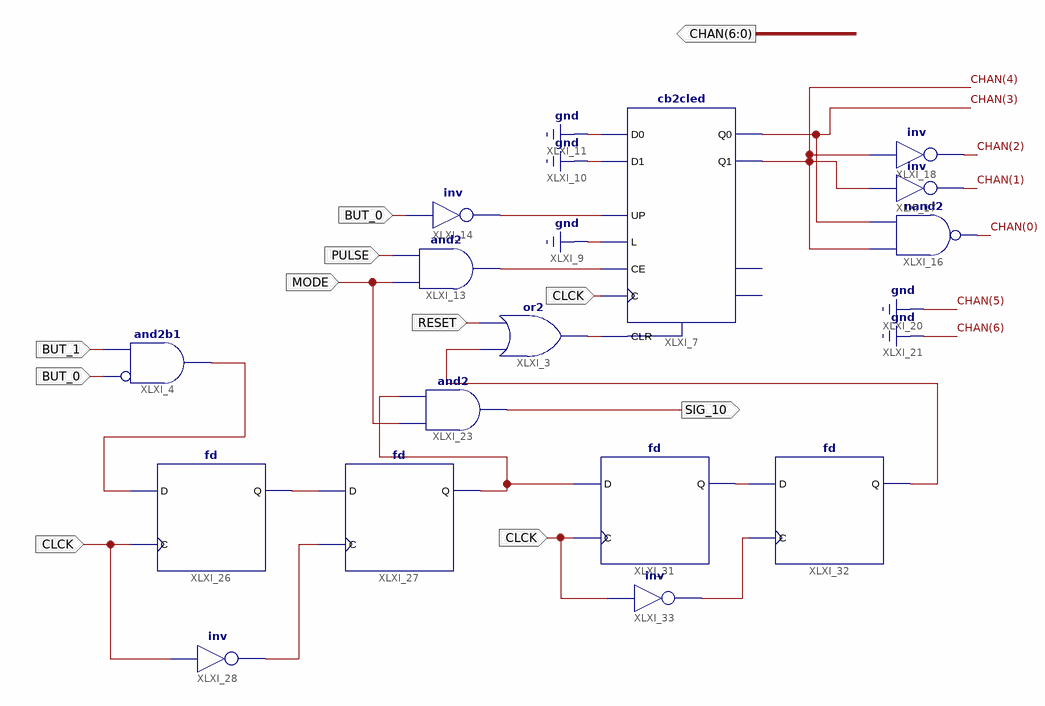
[diagram p0: schematic sheet 1]
// Xilinx ISE schematic MODE_3.sch (spartan3e) as structural Verilog: 15 symbols, 8 ports
module MODE_3 (
  input  CLCK,
  input  RESET,
  input  BUT_0,
  input  MODE,
  input  PULSE,
  input  BUT_1,
  output [6:0] CHAN,
  output SIG_10
);

  wire XLXN_5, XLXN_15, XLXN_16, XLXN_17, XLXN_25, XLXN_26, XLXN_27, XLXN_28, XLXN_32, XLXN_33;

  or XLXI_3 (XLXN_5, XLXN_33, RESET);
  cb2cled XLXI_7 (
    .C(CLCK), .CE(XLXN_16), .CLR(XLXN_5), .D0(1'b0), .D1(1'b0), .L(1'b0), .UP(XLXN_15), .Q0(CHAN[3]),
    .Q1(CHAN[4]));  // open: CEO, TC
  and XLXI_13 (XLXN_16, MODE, PULSE);
  not XLXI_14 (XLXN_15, BUT_0);
  nand XLXI_16 (CHAN[0], CHAN[4], CHAN[3]);
  not XLXI_17 (CHAN[1], CHAN[4]);
  not XLXI_18 (CHAN[2], CHAN[4]);
  and XLXI_23 (SIG_10, MODE, XLXN_17);
  and XLXI_4 (XLXN_27, ~BUT_0, BUT_1);  // and2b1
  fd XLXI_26 (.C(CLCK), .D(XLXN_27), .Q(XLXN_26));
  fd XLXI_27 (.C(XLXN_25), .D(XLXN_26), .Q(XLXN_17));
  not XLXI_28 (XLXN_25, CLCK);
  fd XLXI_31 (.C(CLCK), .D(XLXN_17), .Q(XLXN_28));
  fd XLXI_32 (.C(XLXN_32), .D(XLXN_28), .Q(XLXN_33));
  not XLXI_33 (XLXN_32, CLCK);

  assign CHAN[6:5] = 2'b00;
endmodule
